# Altium schematic sheet HC-SR501.SchDoc
size A3; SheetNumber: 6; SheetTotal: 6
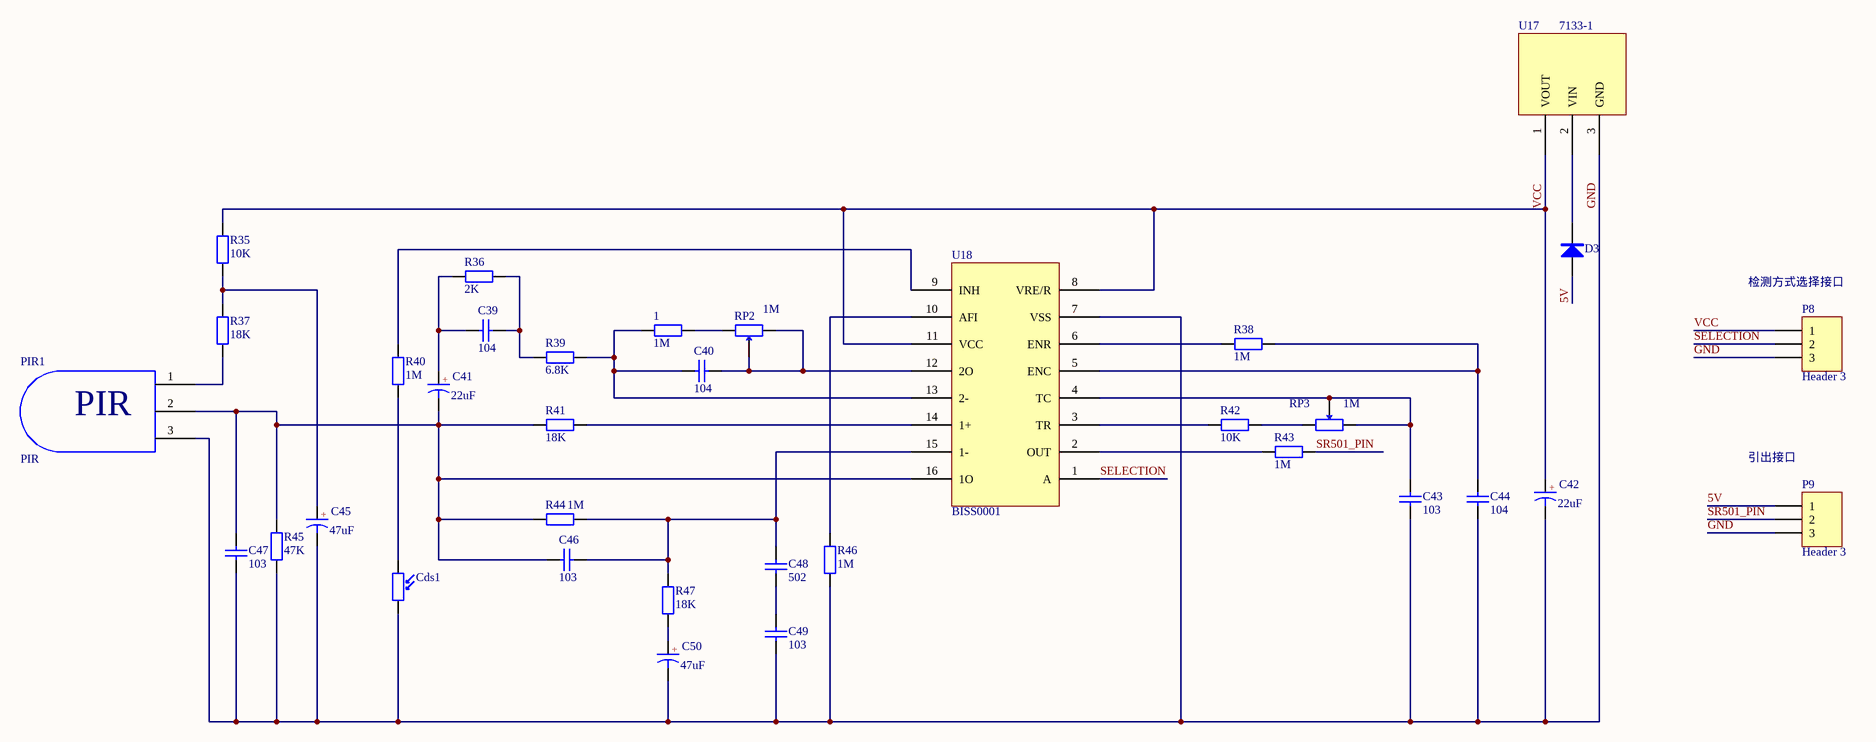
[diagram p0: HC-SR501.SchDoc]

## Parts
1  1M  [R0805_L]
C39  104  [C0805_L]
C40  104  [C0805_L]
C41  22uF  [CE-1.5*4*8]
C42  22uF  [CE-1.5*4*8]
C43  103  [C0805_L]
C44  104  [C0805_L]
C45  47uF  [CE-1.5*4*8]
C46  103  [C0805_L]
C47  103  [C0805_L]
C48  502  [C0805_L]
C49  103  [C0805_L]
C50  47uF  [CE-1.5*4*8]
Cds1  10K  [RG5528]  (value not drawn)
D3  M7  [SMA]  (value not drawn)
P8  Header 3  [HDR1X3]
P9  Header 3  [HDR1X3]
PIR1  PIR
R35  10K  [R0805_L]
R36  2K  [R0805_L]
R37  18K  [R0805_L]
R38  1M  [R0805_L]
R39  6.8K  [R0805_L]
R40  1M  [R0805_L]
R41  18K  [R0805_L]
R42  10K  [R0805_L]
R43  1M  [R0805_L]
R44  1M  [R0805_L]
R45  47K  [R0805_L]
R46  1M  [R0805_L]
R47  18K  [R0805_L]
RP2  1M  [3296W]
RP3  1M  [3296W]
U17  7133-1
U18  BISS0001

## Nets
5V: D3.1(A) P9.1
GND: C42.2 C43.2 C44.2 C45.2 C47.1 C49.2 C50.2 Cds1.2 P8.3 P9.3 PIR1.3 R45.1 R46.1 U17.3(GND) U18.7(VSS)
SELECTION: P8.2 U18.1(A)
SR501_PIN: P9.2 R43.1
VCC: C42.1 P8.1 R35.2 U17.1(VOUT) U18.8(VRE/R) U18.11(VCC)
Net1_1: 1.1 RP2.3
Net1_2: 1.2 C40.2 R39.1 U18.13(2-)
NetC39_1: C39.1 R36.1 R39.2
NetC39_2: C39.2 C41.1 R36.2
NetC40_1: C40.1 RP2.1 RP2.2 U18.12(2O)
NetC41_2: C41.2 C46.2 C47.2 PIR1.2 R41.2 R44.2 R45.2 U18.16(1O)
NetC43_1: C43.1 RP3.2 RP3.3 U18.4(TC)
NetC44_1: C44.1 R38.1 U18.5(ENC)
NetC45_1: C45.1 R35.1 R37.2
NetC46_1: C46.1 C48.1 R44.1 R47.1 U18.15(1-)
NetC48_2: C48.2 C49.1
NetC50_1: C50.1 R47.2
NetCds1_1: Cds1.1 R40.1
NetD3_2: D3.2(K) U17.2(VIN)
NetPIR1_1: PIR1.1(VIN) R37.1
NetR38_2: R38.2 U18.6(ENR)
NetR40_2: R40.2 U18.9(INH)
NetR41_1: R41.1 U18.14(1+)
NetR42_1: R42.1 RP3.1
NetR42_2: R42.2 U18.3(TR)
NetR43_2: R43.2 U18.2(OUT)
NetR46_2: R46.2 U18.10(AFI)

## Notes on the sheet
- (near P8) 检测方式选择接口
- (near P9) 引出接口
- (in symbol CE) +

## Library data of the parts
1 R35-R47 = R: 贴片电阻; 当前库版本V2022.10.7 @黄晶宝石: 最新版本发布https://shop463601444.taobao.com; BOM名称: 贴片电阻
C39 C40 C43 C44 C46-C49 = C: 贴片电容/MLCC电容; BOM名称: 无极性贴片电容; 联系下单店铺卖家 免费帮你查找封装: 联系下单店铺卖家 免费技术支持
C41 C42 C45 C50 = CE: 直插电解电容; 联系下单店铺卖家 免费帮你查找封装: 联系下单店铺卖家 免费技术支持; BOM名称: 直插电解电容
Cds1 = RG5516: 光敏电阻; 联系下单店铺卖家 免费帮你查找封装: 联系下单店铺卖家 免费技术支持; BOM名称: 光敏电阻
D3 = M7: 整流二极管; 当前库版本V2022.10.7 @淘宝卖家:黄晶宝石: 最新版本发布https://shop463601444.taobao.com; BOM名称: 整流二极管
P8 P9 = Header 3: Header, 3-Pin; LatestRevisionDate: 17-Jul-2002; LatestRevisionNote: Re-released for DXP Platform.; Publisher: Altium Limited
PIR1 = PIR: 热释电传感器
RP2 RP3 = RP: 单联电位器; BOM名称: 插件电位器; 联系下单店铺卖家 免费帮你查找封装: 联系下单店铺卖家 免费技术支持
U17 = 7133-1: 稳压芯片
U18 = BISS0001: 传感信号处理集成电路